# EAGLE board BEP33_rev1 (EAGLE 7.7.0), part 1 of 3
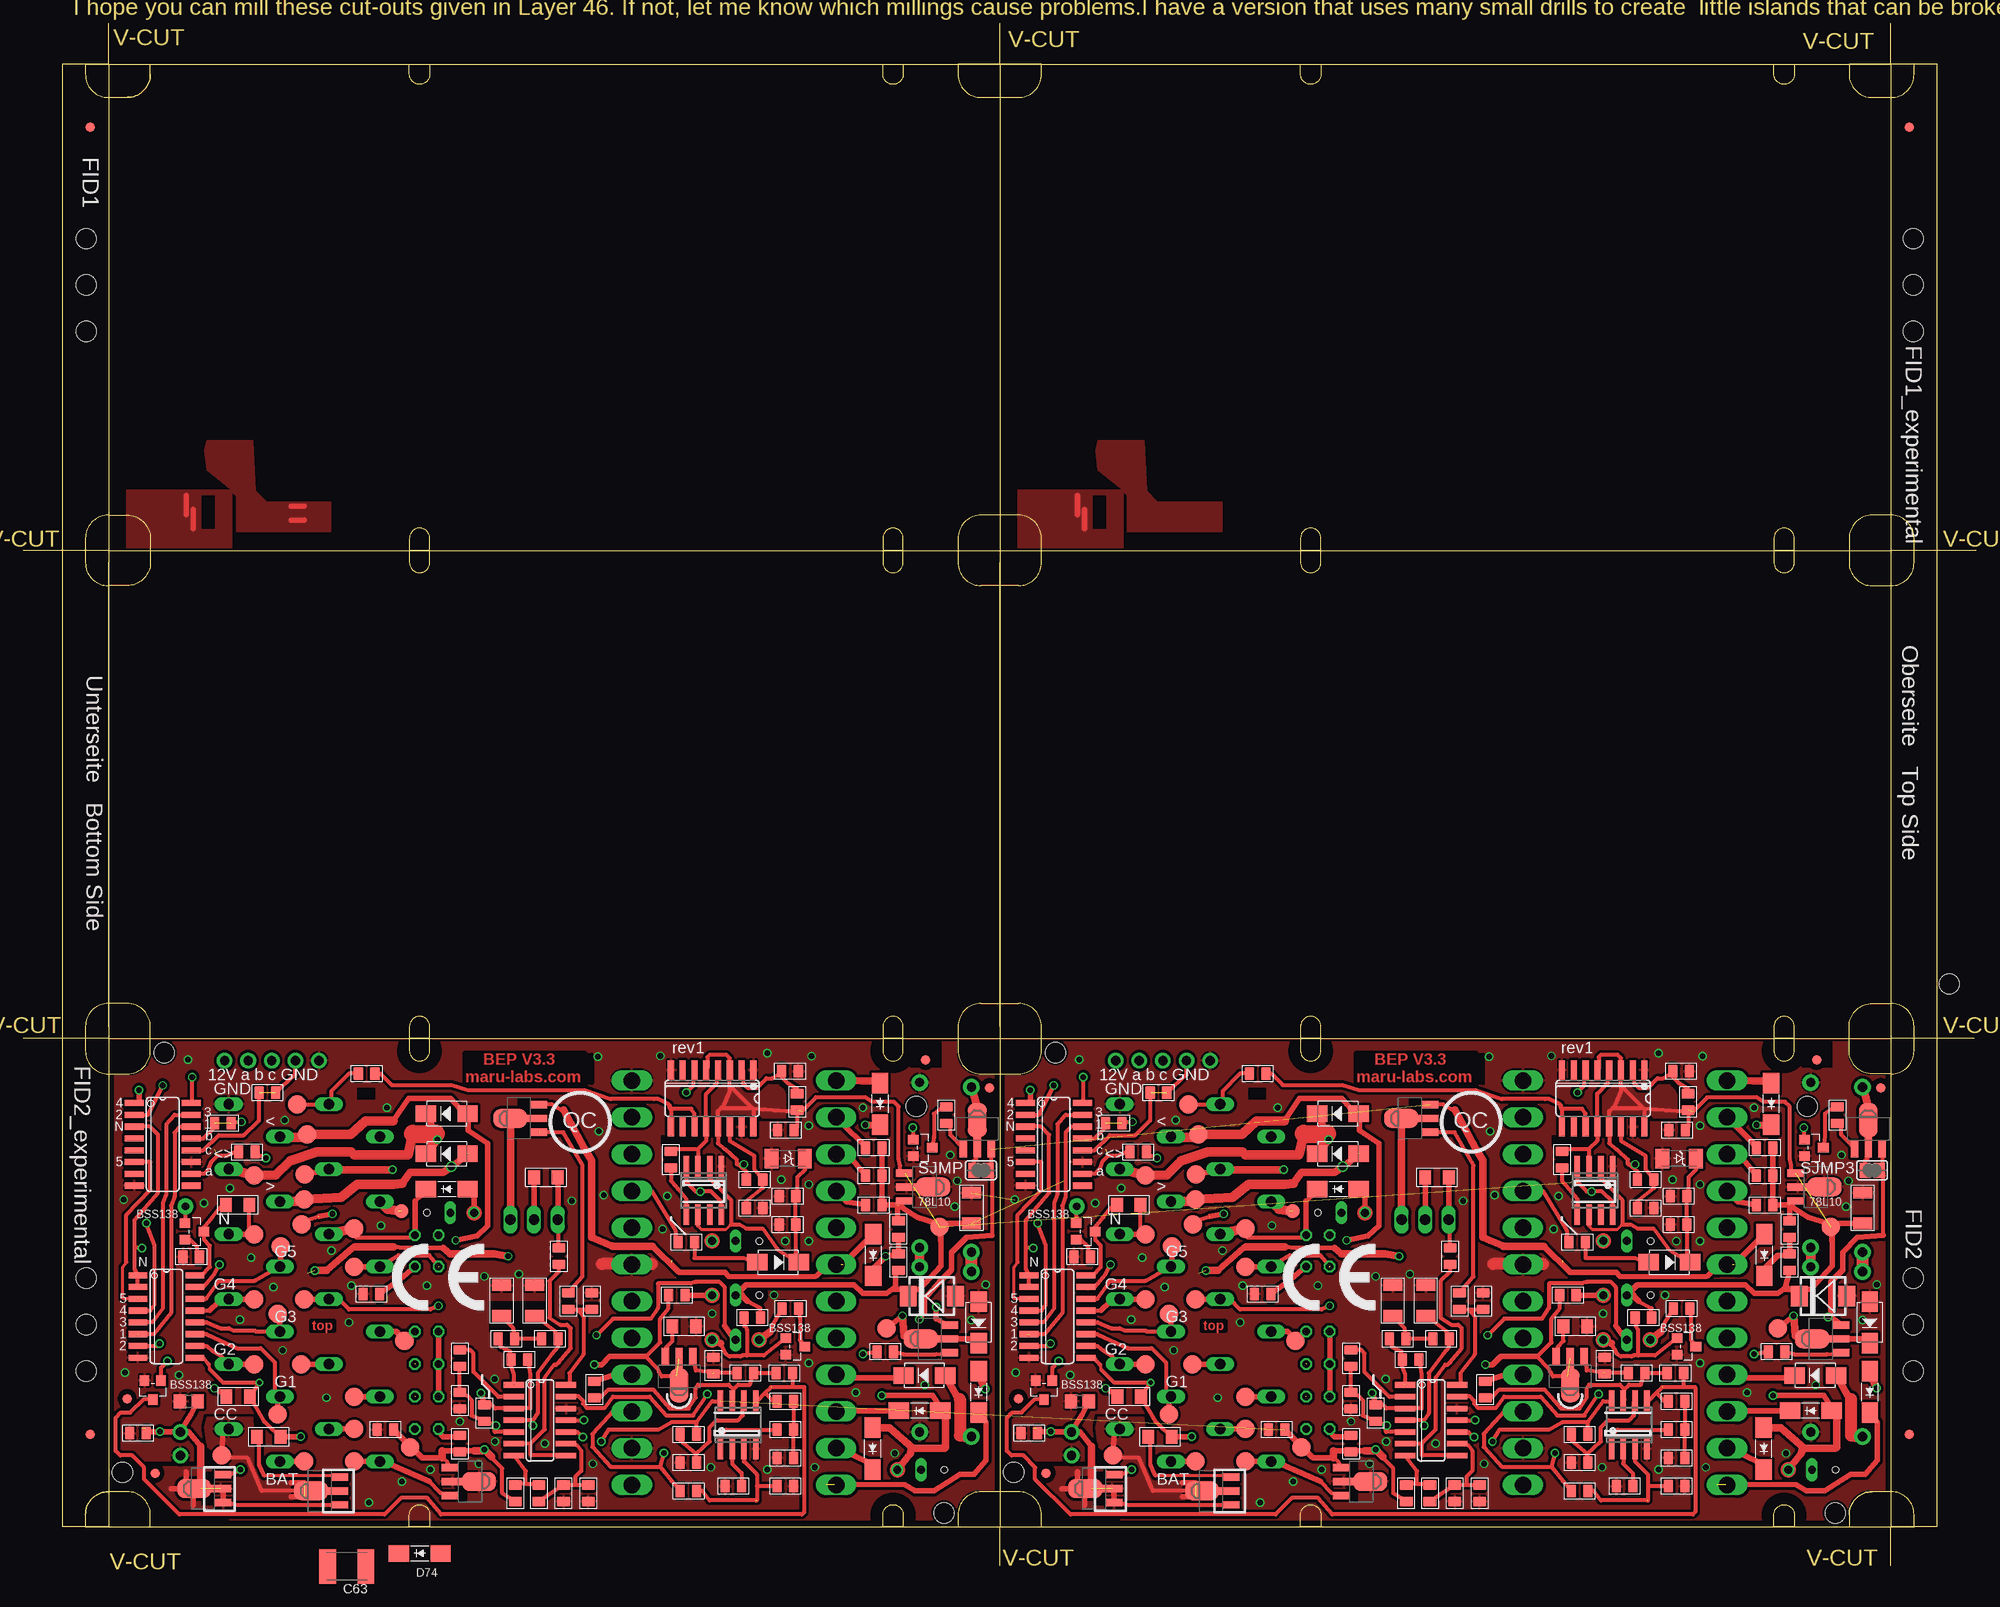
[diagram p5: board, top side]
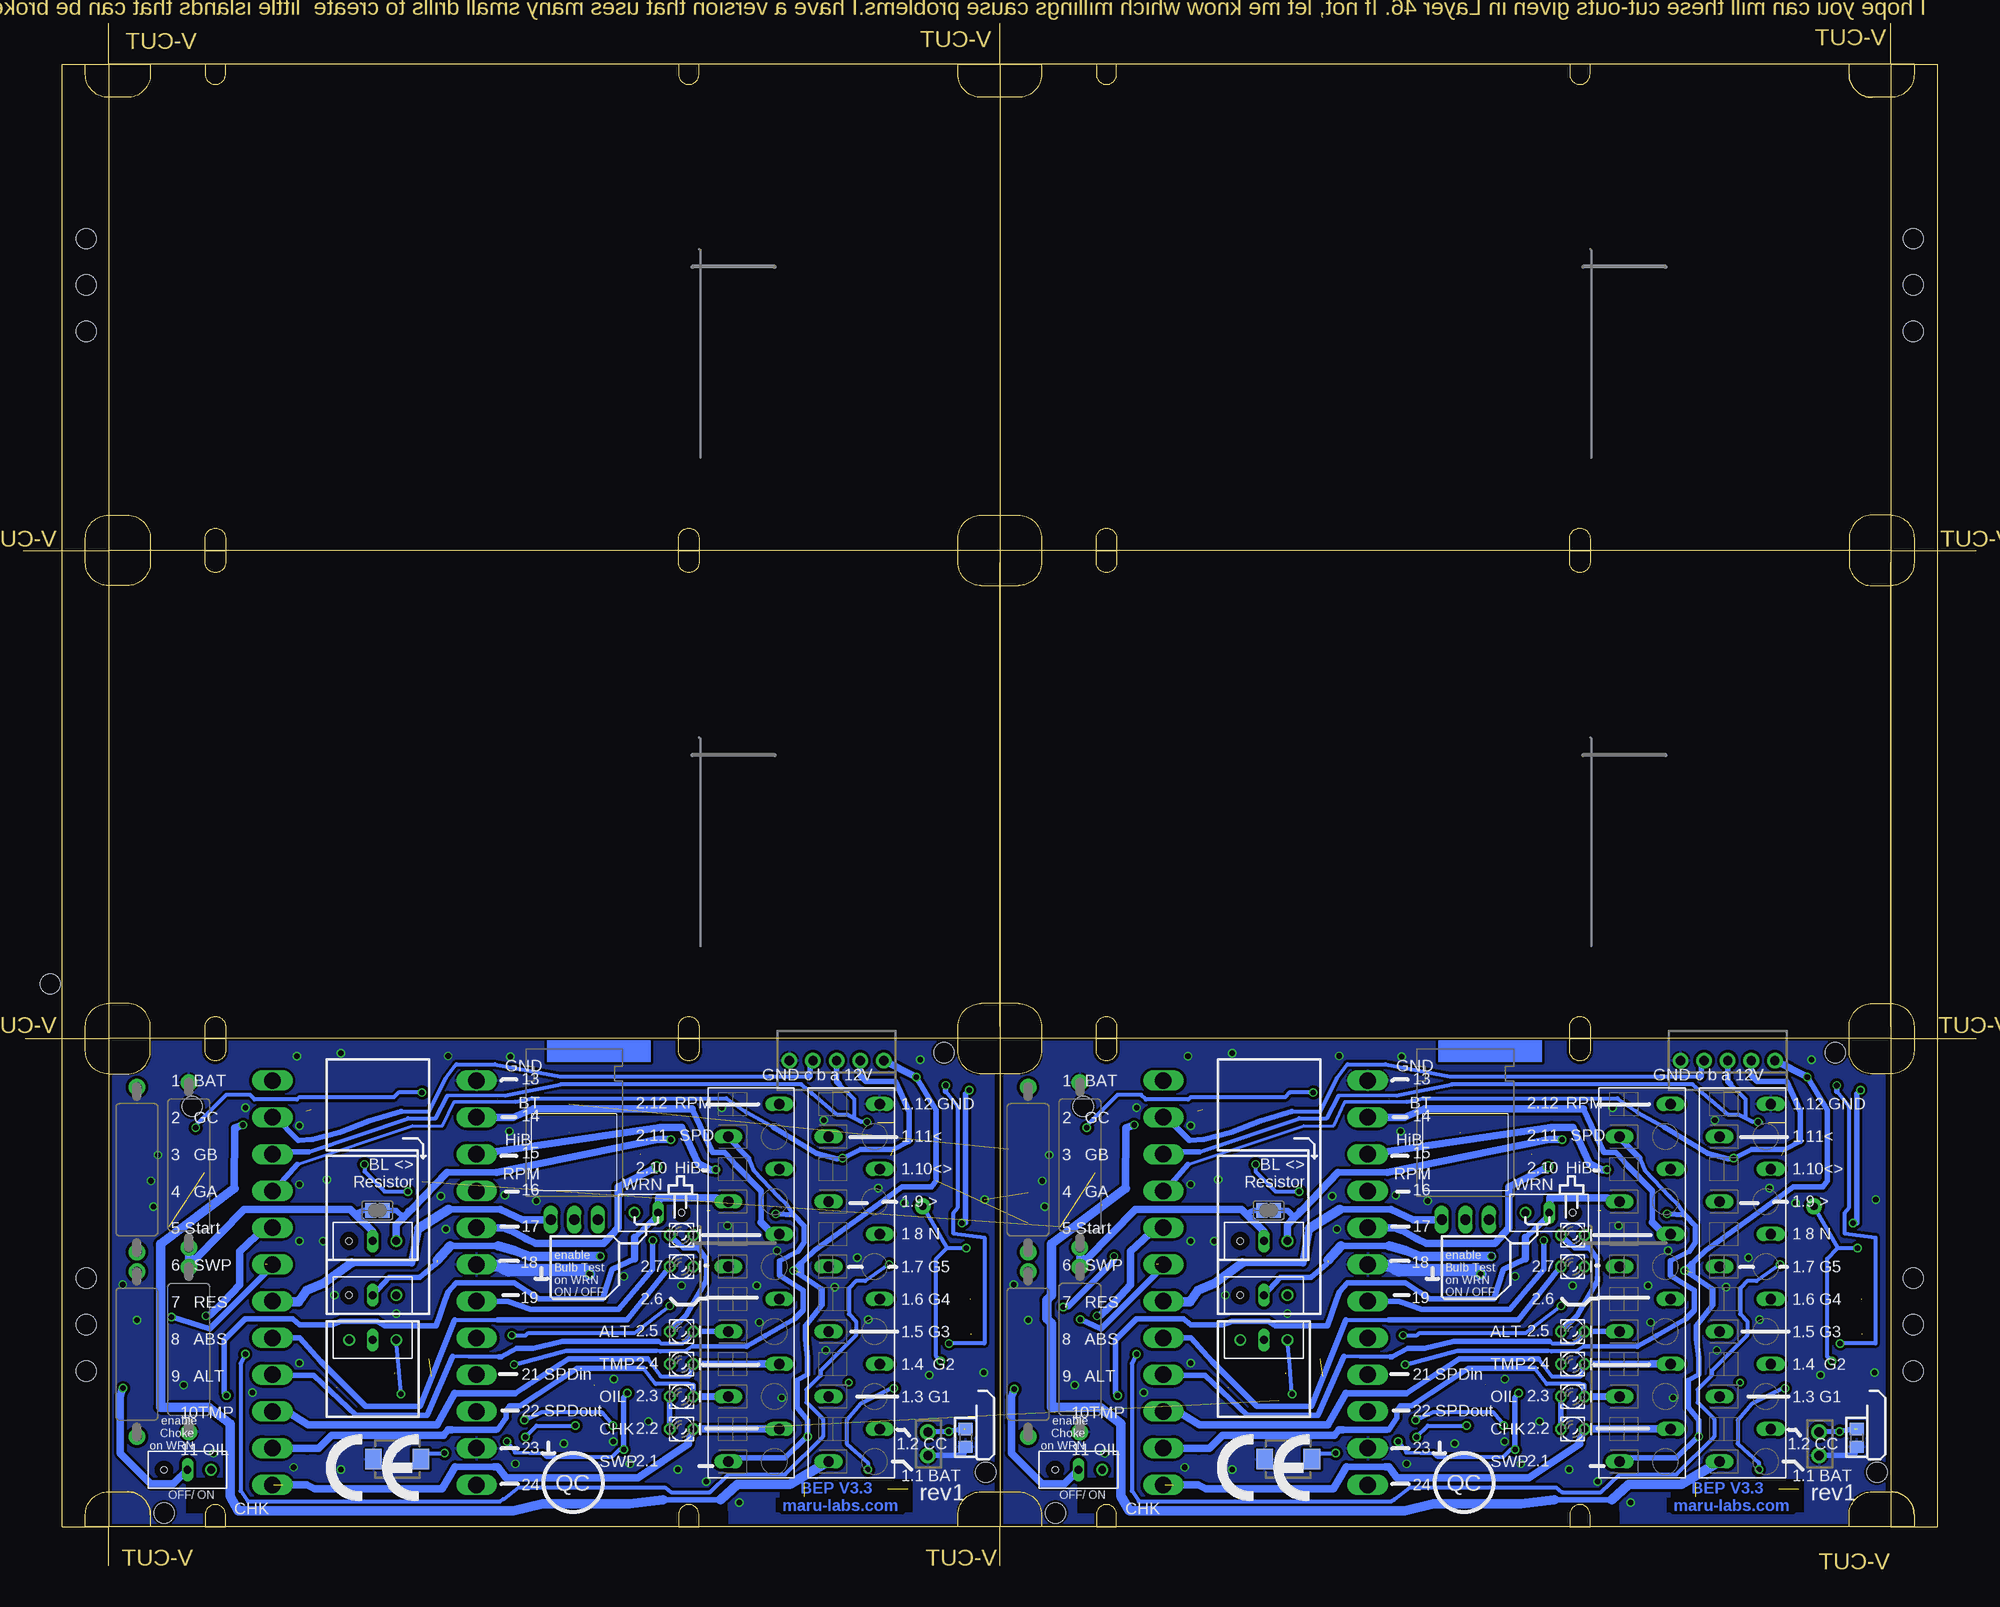
[diagram p6: board, bottom side, seen from below]

Size 210.4 x 166.2 mm. Coordinates in mm from the lower left corner, seen from the top.
Outline: 9.2,4.2 4.2,4.2 4.2,56.8
Outline: 9.2,56.8 4.2,56.8
Outline: 4.2,109.4 4.2,56.8
Outline: 9.2,161.8 9.2,109.4
Outline: 9.2,109.4 4.2,109.4
Outline: 4.2,109.4 4.2,161.8 9.2,161.8
Outline: 9.2,161.8 105.2,161.8
Outline: 201.2,4.2 206.2,4.2 206.2,56.8
Outline: 206.2,56.8 201.2,56.8
Outline: 206.2,56.8 206.2,109.4
Outline: 201.2,161.8 201.2,109.4
Outline: 105.2,161.8 105.2,109.4
Outline: 206.2,109.4 201.2,109.4
Outline: 206.2,109.4 206.2,161.8 201.2,161.8
Outline: 105.2,161.8 201.2,161.8
Outline: 105.2,161.8 105.2,166.2
Outline: 105.2,0 105.2,4.2
Outline: 201.2,0 201.2,4.2
Outline: 201.2,161.8 201.2,166.2
Outline: 9.2,161.8 9.2,166.2
Outline: 4.2,109.4 0,109.4
Outline: 4.2,56.8 0,56.8
Outline: 210.2,56.8 206.2,56.8
Outline: 210.4,109.4 206.2,109.4
Outline: 9.2,58.1 9.2,108.1
Outline: 105.2,58.1 105.2,108.1
Outline: 9.2,4.2 105.2,4.2
Outline: 9.2,56.8 9.2,4.2
Outline: 9.2,56.8 105.2,56.8
Outline: 9.2,109.4 9.2,56.8
Outline: 9.2,109.4 105.2,109.4
Outline: 105.2,4.2 201.2,4.2
Outline: 105.2,56.8 105.2,4.2
Outline: 201.2,56.8 201.2,4.2
Outline: 105.2,56.8 201.2,56.8
Outline: 105.2,109.4 105.2,56.8
Outline: 201.2,109.4 201.2,56.8
Outline: 105.2,109.4 201.2,109.4
Copper layers (1*16): Top 0.035mm / dielectric 1.5mm / Bottom 0.035mm
Design rules "Vorlage BEP3 und hoeher multi-cb_035um-cu": minimum track width 6mil, minimum drill 12mil, track to track 12mil, track to pad 12mil, pad to pad 6mil, via to via 6mil, smd to smd 6mil, copper to edge 10mil, drill to drill 8mil, minimum pad ring 8mil, minimum via ring 6mil, stop-mask expansion 3mil, vias tented up to drill 0mil, thermal gap 8mil
Holes 2.18 mm at 10.7,10.1 96.2,49.5 99.2,5.7 15.2,55.3 6.8,143 6.8,21 6.8,26 6.8,138 207.5,62.7 203.6,143 203.6,21 203.6,26 203.6,138 6.8,31 6.8,133 203.6,133 203.6,31 106.7,10.1 192.2,49.5 195.2,5.7 111.2,55.3
tRestrict: area 50.2,25.2 to 56.7,28.5; area 36,50.2 to 37.9,51.5; area 67.6,20.8 to 69.4,22.8; area 53.3,46.1 to 54.7,50.4; area 46.5,6.9 to 47.8,11.4; area 19.2,6.6 to 20.6,10.1; area 95.6,53.7 to 98.9,56.4; area 68.7,45.2 to 72.9,46.4; area 22.6,38.2 to 23.7,39.9; area 16.5,56.8 to 91.2,56.8; area 47.6,52 to 61.3,55.1; area 91.5,3.3 to 95.9,7.7; area 91.5,53.3 to 95.9,57.7; area 40.5,53.3 to 44.9,57.7; area 100.8,53.1 to 105,56.8; area 100.8,4.3 to 105.1,7.9; area 9.3,53.1 to 13.6,56.7; area 50.2,77.8 to 56.7,81.1; area 36,102.8 to 37.9,104.1; area 67.6,73.4 to 69.4,75.4; area 53.3,98.7 to 54.7,103; area 46.5,59.5 to 47.8,64; area 19.2,59.2 to 20.6,62.7; area 97.6,79.2 to 99.2,80.4; area 95.6,106.3 to 98.9,109; area 68.7,97.8 to 72.9,99; area 22.6,90.8 to 23.7,92.5; area 16.5,109.4 to 91.2,109.4; area 47.6,104.6 to 61.3,107.7; area 91.5,55.9 to 95.9,60.3; area 91.5,105.9 to 95.9,110.3; area 40.5,105.9 to 44.9,110.3; area 100.8,105.7 to 105,109.4; area 100.8,56.9 to 105.1,60.5; area 9.3,105.7 to 13.6,109.3; area 50.2,130.4 to 56.7,133.7; area 36,155.4 to 37.9,156.7; area 67.6,126 to 69.4,128; area 53.3,151.3 to 54.7,155.6; area 46.5,112.1 to 47.8,116.6; area 19.2,111.8 to 20.6,115.3; area 97.6,131.8 to 99.2,133; area 95.6,158.9 to 98.9,161.6; area 68.7,150.4 to 72.9,151.6; area 22.6,143.4 to 23.7,145.1; area 16.5,162 to 91.2,162; area 47.6,157.2 to 61.3,160.3; area 91.5,108.5 to 95.9,112.9; area 91.5,158.5 to 95.9,162.9; area 40.5,158.5 to 44.9,162.9; area 100.8,158.3 to 105,162; area 100.8,109.5 to 105.1,113.1; area 9.3,158.3 to 13.6,161.9; area 146.2,25.2 to 152.7,28.5; area 132,50.2 to 133.9,51.5; area 163.6,20.8 to 165.4,22.8; area 149.3,46.1 to 150.7,50.4; area 142.5,6.9 to 143.8,11.4; area 115.2,6.6 to 116.6,10.1; area 193.6,26.6 to 195.2,27.8; area 191.6,53.7 to 194.9,56.4; area 164.7,45.2 to 168.9,46.4; area 118.6,38.2 to 119.7,39.9; area 112.5,56.8 to 187.2,56.8; area 143.6,52 to 157.3,55.1; area 187.5,3.3 to 191.9,7.7; area 187.5,53.3 to 191.9,57.7; area 136.5,53.3 to 140.9,57.7; area 196.8,53.1 to 201,56.8; area 196.8,4.3 to 201.1,7.9; area 105.3,53.1 to 109.6,56.7; area 146.2,77.8 to 152.7,81.1; area 132,102.8 to 133.9,104.1; area 163.6,73.4 to 165.4,75.4; area 149.3,98.7 to 150.7,103; area 142.5,59.5 to 143.8,64; area 115.2,59.2 to 116.6,62.7; area 193.6,79.2 to 195.2,80.4; area 191.6,106.3 to 194.9,109; area 164.7,97.8 to 168.9,99; area 118.6,90.8 to 119.7,92.5; area 112.5,109.4 to 187.2,109.4; area 143.6,104.6 to 157.3,107.7; area 187.5,55.9 to 191.9,60.3; area 187.5,105.9 to 191.9,110.3; area 136.5,105.9 to 140.9,110.3; area 196.8,105.7 to 201,109.4; area 196.8,56.9 to 201.1,60.5; area 105.3,105.7 to 109.6,109.3; area 146.2,130.4 to 152.7,133.7; area 132,155.4 to 133.9,156.7; area 163.6,126 to 165.4,128; area 149.3,151.3 to 150.7,155.6; area 142.5,112.1 to 143.8,116.6; area 115.2,111.8 to 116.6,115.3; area 193.6,131.8 to 195.2,133; area 191.6,158.9 to 194.9,161.6; area 164.7,150.4 to 168.9,151.6; area 118.6,143.4 to 119.7,145.1; area 112.5,162 to 187.2,162; area 143.6,157.2 to 157.3,160.3; area 187.5,108.5 to 191.9,112.9; area 187.5,158.5 to 191.9,162.9; area 136.5,158.5 to 140.9,162.9; area 196.8,158.3 to 201,162; area 196.8,109.5 to 201.1,113.1; area 105.3,158.3 to 109.6,161.9
bRestrict: area 18.6,5.8 to 28.8,9.3; area 28.7,5.8 to 33.3,7.3; area 38.5,5.1 to 45,7.3; area 90.8,5.7 to 96.8,9.5; area 41.5,54.3 to 43.9,56.7; area 41.3,55.4 to 44.1,56.8; area 92.5,54.3 to 94.9,56.7; area 92.3,55.4 to 95.1,56.8; area 92.4,4.2 to 95,6.8; area 41.4,4.2 to 44,6.9; area 38.5,4.2 to 45.6,5.9; area 100.8,53.1 to 105,56.8; area 9.4,4.2 to 13.6,7.9; area 9.3,53.1 to 13.6,56.7; area 18.6,58.4 to 28.8,62; area 28.7,58.4 to 33.3,59.9; area 38.5,57.7 to 45,59.9; area 90.8,58.3 to 96.8,62.1; area 41.5,106.9 to 43.9,109.3; area 41.3,108 to 44.1,109.4; area 92.5,106.9 to 94.9,109.3; area 92.3,108 to 95.1,109.4; area 92.4,56.8 to 95,59.4; area 41.4,56.8 to 44,59.5; area 38.5,56.8 to 45.6,58.5; area 100.8,105.7 to 105,109.4; area 9.4,56.8 to 13.6,60.5; area 9.3,105.7 to 13.6,109.3; area 18.6,111 to 28.8,114.5; area 28.7,111 to 33.3,112.5; area 38.5,110.3 to 45,112.5; area 90.8,110.9 to 96.8,114.7; area 41.5,159.5 to 43.9,161.9; area 41.3,160.6 to 44.1,162; area 92.5,159.5 to 94.9,161.9; area 92.3,160.6 to 95.1,162; area 92.4,109.4 to 95,112; area 41.4,109.4 to 44,112.1; area 38.5,109.4 to 45.6,111.1; area 100.8,158.3 to 105,162; area 9.4,109.4 to 13.6,113.1; area 9.3,158.3 to 13.6,161.9; area 114.6,5.8 to 124.8,9.3; area 124.7,5.8 to 129.3,7.3; area 134.5,5.1 to 141,7.3; area 186.8,5.7 to 192.8,9.5; area 137.5,54.3 to 139.9,56.7; area 137.3,55.4 to 140.1,56.8; area 188.5,54.3 to 190.9,56.7; area 188.3,55.4 to 191.1,56.8; area 188.4,4.2 to 191,6.8; area 137.4,4.2 to 140,6.9; area 134.5,4.2 to 141.6,5.9; area 196.8,53.1 to 201,56.8; area 105.4,4.2 to 109.6,7.9; area 105.3,53.1 to 109.6,56.7; area 114.6,58.4 to 124.8,62; area 124.7,58.4 to 129.3,59.9; area 134.5,57.7 to 141,59.9; area 186.8,58.3 to 192.8,62.1; area 137.5,106.9 to 139.9,109.3; area 137.3,108 to 140.1,109.4; area 188.5,106.9 to 190.9,109.3; area 188.3,108 to 191.1,109.4; area 188.4,56.8 to 191,59.4; area 137.4,56.8 to 140,59.5; area 134.5,56.8 to 141.6,58.5; area 196.8,105.7 to 201,109.4; area 105.4,56.8 to 109.6,60.5; area 105.3,105.7 to 109.6,109.3; area 114.6,111 to 124.8,114.5; area 124.7,111 to 129.3,112.5; area 134.5,110.3 to 141,112.5; area 186.8,110.9 to 192.8,114.7; area 137.5,159.5 to 139.9,161.9; area 137.3,160.6 to 140.1,162; area 188.5,159.5 to 190.9,161.9; area 188.3,160.6 to 191.1,162; area 188.4,109.4 to 191,112; area 137.4,109.4 to 140,112.1; area 134.5,109.4 to 141.6,111.1; area 196.8,158.3 to 201,162; area 105.4,109.4 to 109.6,113.1; area 105.3,158.3 to 109.6,161.9
Milling: 188 lines

## Footprints (pad centres in the part's own frame; a part is rotated, then mirrored left to right if it is on the bottom)
12-PIN = drill 1.118 long: 1 19.25,-2.45; 2 15.75,3.05; 3 12.25,-2.45; 4 8.75,3.05; 5 5.25,-2.45; 6 1.75,3.05; 7 -1.75,-2.45; 8 -5.25,3.05; 9 -8.75,-2.45; 10 -12.25,3.05; 11 -15.75,-2.45; 12 -19.25,3.05
B2.0 = smd 2 x 2: TP 0,0
C1206 = smd 1.27 x 2.032: 1 -1.651,0; 2 1.651,0
C0805 = smd 1.397 x 1.016: 1 0,0.889; 2 0,-0.889
C1812K = smd 1.8 x 3.7: 1 -2.05,0; 2 2.05,0
DO-214AC_SLIM = smd 2.2 x 1.77: 1 -2.242,0; 2 2.242,0
SOD-123_MINI-SMA = smd 1.5 x 2.1: A 1.8,0; C -1.8,0
DO-214AC = smd 2.2 x 1.77: 1 -2.242,0; 2 2.242,0
DO214AA = smd 1.8 x 2.2: A 2.55,0; C -2.55,0
DO214AA_BI = smd 1.8 x 2.2: A 2.45,0; C -2.65,0
FIDUCIAL_1MM = smd 1 x 1: 1 0,0
FIDUCIAL_1MM_WITH_SOLDERMASK = smd 1 x 1: 1 0,0
SO16 = smd 0.66 x 2.032: 1 -4.445,-3.073; 2 -3.175,-3.073; 3 -1.905,-3.073; 4 -0.635,-3.073; 5 0.635,-3.073; 6 1.905,-3.073; 7 3.175,-3.073; 8 4.445,-3.073; 9 4.445,3.073; 10 3.175,3.073; 11 1.905,3.073; 12 0.635,3.073; 13 -0.635,3.073; 14 -1.905,3.073; 15 -3.175,3.073; 16 -4.445,3.073
TO220H_NOHOLE = drill 1.118 long: 1 -2.54,-10.16; 2 0,-10.16; 3 2.54,-10.16
SO14 = smd 0.6 x 2.2: 1 -3.81,-2.8; 2 -2.54,-2.8; 3 -1.27,-2.8; 4 0,-2.8; 5 1.27,-2.8; 6 2.54,-2.8; 7 3.81,-2.8; 8 3.81,2.8; 9 2.54,2.8; 10 1.27,2.8; 11 0,2.8; 12 -1.27,2.8; 13 -2.54,2.8; 14 -3.81,2.8
SOT89_ROUND = smd 0.8 x 1.8: 1 -1.499,-2.181; 3 1.499,-2.181 | smd 0.8 x 2.3: 2 0,-1.927 | smd 2.032 x 3.65: 2@1 0,0.94
SO08 = smd 0.6 x 2.2: 1 -1.905,-2.6; 2 -0.635,-2.6; 3 0.635,-2.6; 4 1.905,-2.6; 5 1.905,2.6; 6 0.635,2.6; 7 -0.635,2.6; 8 -1.905,2.6
JP2_SMALLPADS = drill 0.85: 1 -2.54,0 | drill 0.85 long: 2 0,0 | hole 0.7: 2.54,0
JP2_ORIG_SMALLPADS = drill 0.85: 1 -2.54,0; 3 2.54,0 | drill 0.85 long: 2 0,0
LD260 = drill 0.813 octagon: A -1.27,0; K 1.27,0
SOT-23 = smd 1.016 x 1.143: 1 -0.889,-1.016; 2 0.889,-1.016; 3 0,1.016
SOT89 = smd 0.8 x 1.8: 1 -1.499,-2.181; 3 1.499,-2.181 | smd 0.8 x 2.3: 2 0,-1.927 | smd 2.032 x 3.65: 2@1 0,0.94
R0805 = smd 1.397 x 1.016: 1 0,0.889; 2 0,-0.889
R1206 = smd 1.27 x 1.524: 1 -1.27,0; 2 1.27,0
R0805' = smd 1.3 x 1.5: 1 -0.95,0; 2 0.95,0
V235/17_1MM = drill 1 pad 1.778: 1 -8.89,0; 2 8.89,0
SJ = smd 1.2 x 1.6: 1 -0.725,0; 2 0.725,0
SJ' = smd 1.168 x 1.6: 1 -0.762,0; 2 0.762,0
B1,27 = smd 1.5 x 1.5: TP 0,0
24-PIN_V2 = drill 1.778 long: 1 -21.78,-11; 2 -17.82,-11; 3 -13.86,-11; 4 -9.9,-11; 5 -5.94,-11; 6 -1.98,-11; 7 1.98,-11; 8 5.94,-11; 9 9.9,-11; 10 13.86,-11; 11 17.82,-11; 12 21.78,-11; 13 -21.78,11; 14 -17.82,11; 15 -13.86,11; 16 -9.9,11; 17 -5.94,11; 18 -1.98,11; 19 1.98,11; 20 5.94,11; 21 9.9,11; 22 13.86,11; 23 17.82,11; 24 21.78,11
22-23-2051 = drill 1 pad 1.676: 1 -5.08,0; 2 -2.54,0; 3 0,0; 4 2.54,0; 5 5.08,0
22-23-2021 = drill 1 pad 1.676: 1 -1.27,0; 2 1.27,0

## Placement (x,y rotation side)
1  [12-PIN]  25.19,30.5 270 bottom
2  [12-PIN]  35.98,30.5 270 bottom
6V  TPSB2.0  [B2.0]  41.7,12.78 0 top
6V3  TPSB2.0  [B2.0]  137.7,12.78 0 top
7  [12-PIN]  121.19,30.5 270 bottom
8  [12-PIN]  131.98,30.5 270 bottom
10V  TPSB2.0  [B2.0]  98.7,36.5 0 top
10V3  TPSB2.0  [B2.0]  194.7,36.5 0 top
C2  10u  [C1206]  102.16,38.56 90 top
C15  4.7u  [C0805]  82.61,53.29 270 top
C27  100u  [C1206]  147.54,28.59 90 top
C28  100u  [C1206]  151.1,28.59 90 top
C29  100nF,  [C0805]  135.03,14.68 270 top
C30  4.7u  [C0805]  178.1,8.59 90 top
C31  100nF.  [C0805]  154.21,7.83 0 top
C32  100nF.  [C0805]  157.26,28.53 0 top
C33  2.2nF  [C0805]  178.34,36.78 90 top
C34  100nF  [C0805]  178.16,46.95 270 top
C35  100nF  [C0805]  174.78,38.56 90 top
C36  100nF,  [C0805]  178.1,11.64 270 top
C37  4.7u  [C0805]  178.61,53.29 270 top
C38  10u  [C1206]  198.16,38.56 90 top
C63  [C1812K]  34.85,-0.05 180 top
C101  4.7u  [C0805]  82.1,8.59 90 top
C102  100nF  [C0805]  82.16,46.95 270 top
C103  100nF,  [C0805]  82.1,11.64 270 top
C104  100nF,  [C0805]  39.03,14.68 270 top
C105  100nF.  [C0805]  58.21,7.83 0 top
C106  100nF.  [C0805]  61.26,28.53 0 top
C107  100u  [C1206]  51.54,28.59 90 top
C108  100u  [C1206]  55.1,28.59 90 top
C109  2.2nF  [C0805]  82.34,36.78 90 top
C110  100nF  [C0805]  78.78,38.56 90 top
D1  SS12  [DO-214AC_SLIM]  91.56,33.49 270 top
D2  SS12  [DO-214AC_SLIM]  92.3,49.78 270 top
D4  Zen11  [SOD-123_MINI-SMA]  82.4,43.88 180 top
D32  1N4007,  [DO-214AC]  141.64,44.4 180 top
D33  1N4007,  [DO-214AC]  141.64,48.72 180 top
D34  1N4007.  [DO-214AC]  193.07,20.53 180 top
D35  1N5817  [DO-214AC_SLIM]  192.56,16.72 180 top
D36  1N5817.  [DO-214AC_SLIM]  187.5,12.64 270 top
D37  1N5817.  [DO-214AC_SLIM]  198.93,18.75 270 top
D38  1N5817  [DO-214AC_SLIM]  141.64,40.59 180 top
D39  1N4007.  [DO-214AC]  198.93,26.24 270 top
D40  1N4007  [DO-214AC]  177.32,32.72 0 top
D41  Zen15  [DO214AA]  193.89,29.07 0 top
D42  SM6TDO214AA_BI  [DO214AA_BI]  170.21,11.51 180 bottom
D43  SS12  [DO-214AC_SLIM]  187.56,33.49 270 top
D44  SS12  [DO-214AC_SLIM]  188.3,49.78 270 top
D45  Zen11  [SOD-123_MINI-SMA]  178.4,43.88 180 top
D74  SS12  [DO-214AC_SLIM]  42.73,1.35 180 top
D101  Zen15  [DO214AA]  97.89,29.07 0 top
D102  1N4007,  [DO-214AC]  45.64,44.4 180 top
D103  1N4007,  [DO-214AC]  45.64,48.72 180 top
D104  SM6TDO214AA_BI  [DO214AA_BI]  74.21,11.51 180 bottom
D105  1N4007.  [DO-214AC]  102.93,26.24 270 top
D106  1N4007.  [DO-214AC]  97.07,20.53 180 top
D107  1N5817  [DO-214AC_SLIM]  96.56,16.72 180 top
D108  1N5817.  [DO-214AC_SLIM]  91.5,12.64 270 top
D109  1N5817.  [DO-214AC_SLIM]  102.93,18.75 270 top
D110  1N5817  [DO-214AC_SLIM]  45.64,40.59 180 top
D112  1N4007  [DO-214AC]  81.32,32.72 0 top
FID1  FIDUCIAL  [FIDUCIAL_1MM]  7.2,155 0 top
FID1B  FIDUCIALFIDUCIAL_1MM_WITH_SOLDERMASK  [FIDUCIAL_1MM_WITH_SOLDERMASK]  203.2,155 0 top
FID2  FIDUCIAL  [FIDUCIAL_1MM]  203.2,14.2 0 top
FID2B  FIDUCIALFIDUCIAL_1MM_WITH_SOLDERMASK  [FIDUCIAL_1MM_WITH_SOLDERMASK]  7.2,14.2 0 top
FID11  FIDUCIAL  [FIDUCIAL_1MM]  193.2,54.5 0 top
FID12  FIDUCIAL  [FIDUCIAL_1MM]  107.2,18 0 top
FID13  FIDUCIAL  [FIDUCIAL_1MM]  110.2,10 0 top
FID14  FIDUCIAL  [FIDUCIAL_1MM]  200.1,51.5 0 top
FID101  FIDUCIAL  [FIDUCIAL_1MM]  97.2,54.5 0 top
FID102  FIDUCIAL  [FIDUCIAL_1MM]  11.2,18 0 top
FID103  FIDUCIAL  [FIDUCIAL_1MM]  14.2,10 0 top
FID104  FIDUCIAL  [FIDUCIAL_1MM]  104.1,51.5 0 top
IC19  4028  [SO16]  111.03,45.42 270 top
IC20  317TO202H_NOHOLE  [TO220H_NOHOLE]  151.03,47.45 0 bottom
IC21  ULN2004  [SO16]  111.43,26.88 270 top
IC22  LM339  [SO14]  151.67,15.7 270 top
IC23  78L06  [SOT89_ROUND]  144.18,9.1 270 top
IC24  555  [SO08]  169.32,40.47 180 top
IC25  4538  [SO16]  170.21,50.37 180 top
IC26  78L10  [SOT89_ROUND]  193.11,40.82 270 top
IC27  LM2904  [SO08]  173.01,15.19 0 top
IC101  LM2904  [SO08]  77.01,15.19 0 top
IC102  78L06  [SOT89_ROUND]  48.18,9.1 270 top
IC104  78L10  [SOT89_ROUND]  97.11,40.82 270 top
IC105  4028  [SO16]  15.03,45.42 270 top
IC107  ULN2004  [SO16]  15.43,26.88 270 top
IC108  LM339  [SO14]  55.67,15.7 270 top
IC109  317TO202H_NOHOLE  [TO220H_NOHOLE]  55.03,47.45 0 bottom
IC110  555  [SO08]  73.32,40.47 180 top
IC111  4538  [SO16]  74.21,50.37 180 top
JP11  [JP2_SMALLPADS]  172.75,29.16 180 bottom
JP12  JP2E_ORIG  [JP2_ORIG_SMALLPADS]  172.75,24.34 180 bottom
JP13  [JP2_SMALLPADS]  192.7,10.35 180 bottom
JP14  [JP2_SMALLPADS]  142.02,38.05 0 bottom
JP15  [JP2_SMALLPADS]  172.75,35 180 bottom
JP101  [JP2_SMALLPADS]  76.75,29.16 180 bottom
JP102  [JP2_SMALLPADS]  96.7,10.35 180 bottom
JP103  [JP2_SMALLPADS]  46.02,38.05 0 bottom
JP104  [JP2_SMALLPADS]  76.75,35 180 bottom
JP105  JP2E_ORIG  [JP2_ORIG_SMALLPADS]  76.75,24.34 180 bottom
LED13  [LD260]  139.48,14.75 0 bottom
LED14  [LD260]  139.48,18.25 0 bottom
LED15  [LD260]  139.48,21.75 0 bottom
LED16  [LD260]  139.48,25.25 0 bottom
LED17  [LD260]  139.48,32.25 0 bottom
LED18  [LD260]  139.48,35.62 0 bottom
LED101  [LD260]  43.48,32.25 0 bottom
LED102  [LD260]  43.48,14.75 0 bottom
LED103  [LD260]  43.48,18.25 0 bottom
LED104  [LD260]  43.48,21.75 0 bottom
LED105  [LD260]  43.48,25.25 0 bottom
LED106  [LD260]  43.48,35.62 0 bottom
Q1  J1  [SOT-23]  13.97,18.96 180 top
Q2  BA  [SOT89]  102.77,47.08 0 top
Q3  J1  [SOT-23]  96.9,45.05 270 top
Q24  BA  [SOT89]  193.64,24.46 90 top
Q25  BA.  [SOT89]  115.35,8.33 90 top
Q26  BA.  [SOT89]  127.93,8.08 90 top
Q27  BA  [SOT89]  149.38,48.21 90 top
Q28  MY  [SOT89]  166.66,20.4 180 top
Q29  J1  [SOT-23]  179.17,23.64 270 top
Q30  J1  [SOT-23]  114.46,36.02 270 top
Q31  J1  [SOT-23]  109.97,18.96 180 top
Q32  BA  [SOT89]  198.77,47.08 0 top
Q33  J1  [SOT-23]  192.9,45.05 270 top
Q101  BA.  [SOT89]  31.93,8.08 90 top
Q102  BA.  [SOT89]  19.35,8.33 90 top
Q103  MY  [SOT89]  70.66,20.4 180 top
Q104  BA  [SOT89]  97.64,24.46 90 top
Q105  BA  [SOT89]  53.38,48.21 90 top
Q106  J1  [SOT-23]  18.46,36.02 270 top
Q107  J1  [SOT-23]  83.17,23.64 270 top
R1  104  [R0805]  26.3,51 90 top
R2  104  [R0805]  21.5,47.7 90 top
R3  104  [R0805]  24.1,44.6 90 top
R4  100  [R0805]  18.1,33.3 90 top
R5  13  [R1206]  71.2,25.8 0 top
R6  2201  [R0805]  74.36,21.6 180 top
R8  4701  [R0805]  99.43,48.58 180 top
R9  13  [R1206]  23.1,38.9 0 top
R10  104  [R0805]  83.37,49.99 0 top
R12  100  [R0805]  94.29,32.72 0 top
R13  100  [R0805]  94.29,36.27 180 top
R101  102  [R0805]  12.36,14.3 270 top
R102  13  [R1206]  26.46,13.92 180 top
R103  R_user  [R0805']  17.84,17.73 180 top
R104  R_user  [R0805']  12.87,13.79 270 bottom
R105  4701  [R0805]  71.67,8.08 270 top
R106  13  [R1206]  23.16,18.24 180 top
R107  1002  [R0805]  76.5,8.59 90 top
R108  1002  [R0805]  82.1,14.68 270 top
R109  104  [R0805]  91.61,45.04 90 top
R110  104  [R0805]  91.61,42.05 90 top
R111  104  [R0805]  91.61,38.88 90 top
R112  102  [R0805]  82.1,17.73 270 top
R113  1002  [R0805]  71.67,14.18 90 top
R114  1002  [R0805]  71.67,11.13 90 top
R115  102  [R0805]  61.51,19 0 top
R116  4701  [R0805]  77.81,20.78 270 top
R117  2702  [R0805]  81.98,20.78 90 top
R119  2201  [R0805]  70.4,29.16 90 top
R120  1002  [R0805]  57.7,33.35 180 top
R121  1502  [R0805]  53,7.83 0 top
R122  2702  [R0805]  55.54,7.83 0 top
R123  2702  [R0805]  60.88,7.83 180 top
R124  1002  [R0805]  53.45,22.24 270 top
R125  104  [R0805]  52.05,24.46 270 top
R126  4701  [R0805]  58.72,28.53 0 top
R127  47  [V235/17_1MM]  102.15,22.81 90 bottom
R128  102  [R0805]  92.88,23.07 90 top
R129  47  [V235/17_1MM]  102.15,42.69 90 bottom
R130  104  [R0805]  56.75,24.46 270 top
R131  1502  [R0805]  49.7,16.46 180 top
R132  1002  [R0805]  47.03,17.8 180 top
R133  2201  [R0805]  47.03,22.37 0 top
R134  13  [R1206]  56.3,41.86 180 top
R135  104  [R0805]  78.53,26.75 270 top
R136  47  [V235/17_1MM]  96.56,23.32 90 bottom
R137  47  [V235/17_1MM]  96.56,43.2 270 bottom
R138  100  [R0805]  82.66,27.7 90 top
R140  2702  [R0805]  71.42,34.88 270 top
R141  104  [R0805]  82.34,39.83 270 top
R142  (1000)  [R0805]  47.03,13.16 0 top
R143  (101)  [R0805]  37.51,29.29 270 top
R144  (1002)  [R0805]  69.77,43.77 0 top
R145  2702  [R0805]  78.78,41.61 270 top
R146  1002  [R0805]  37,53.04 90 top
R166  47  [V235/17_1MM]  198.15,22.81 90 bottom
R167  13  [R1206]  152.3,41.86 180 top
R168  47  [V235/17_1MM]  198.15,42.69 90 bottom
R169  104  [R0805]  187.61,45.04 90 top
R170  104  [R0805]  187.61,42.05 90 top
R171  104  [R0805]  187.61,38.88 90 top
R172  4701  [R0805]  167.67,8.08 270 top
R173  1002  [R0805]  172.5,8.59 90 top
R174  1002  [R0805]  153.7,33.35 180 top
R175  1502  [R0805]  149,7.83 0 top
R176  104  [R0805]  148.05,24.46 270 top
R177  104  [R0805]  152.75,24.46 270 top
R178  1502  [R0805]  145.7,16.46 180 top
R179  1002  [R0805]  143.03,17.8 180 top
R180  2201  [R0805]  143.03,22.37 0 top
R181  1002  [R0805]  149.45,22.24 270 top
R182  4701  [R0805]  154.72,28.53 0 top
R183  2702  [R0805]  156.88,7.83 180 top
R184  102  [R0805]  108.36,14.3 270 top
R185  R_user  [R0805']  108.87,13.79 270 bottom
R186  102  [R0805]  157.51,19 0 top
R187  (101)  [R0805]  133.51,29.29 270 top
R188  (1000)  [R0805]  143.03,13.16 0 top
R189  102  [R0805]  188.88,23.07 90 top
R190  13  [R1206]  119.16,18.24 180 top
R191  13  [R1206]  122.46,13.92 180 top
R192  2702  [R0805]  151.54,7.83 0 top
R193  4701  [R0805]  173.81,20.78 270 top
R194  100  [R0805]  178.66,27.7 90 top
R195  104  [R0805]  174.53,26.75 270 top
R196  104  [R0805]  178.34,39.83 270 top
R197  (1002)  [R0805]  165.77,43.77 0 top
R198  2702  [R0805]  167.42,34.88 270 top
R199  47  [V235/17_1MM]  192.56,23.32 90 bottom
R200  47  [V235/17_1MM]  192.56,43.2 270 bottom
R201  2702  [R0805]  174.78,41.61 270 top
R202  2201  [R0805]  166.4,29.16 90 top
R203  1002  [R0805]  133,53.04 90 top
R204  1002  [R0805]  178.1,14.68 270 top
R205  102  [R0805]  178.1,17.73 270 top
R206  2702  [R0805]  177.98,20.78 90 top
R207  1002  [R0805]  167.67,14.18 90 top
R208  1002  [R0805]  167.67,11.13 90 top
R209  R_user  [R0805']  113.84,17.73 180 top
R210  104  [R0805]  122.3,51 90 top
R211  104  [R0805]  117.5,47.7 90 top
R212  104  [R0805]  120.1,44.6 90 top
R213  13  [R1206]  167.2,25.8 0 top
R214  2201  [R0805]  170.36,21.6 180 top
R215  100  [R0805]  114.1,33.3 90 top
R216  13  [R1206]  119.1,38.9 0 top
R217  4701  [R0805]  195.43,48.58 180 top
R218  104  [R0805]  179.37,49.99 0 top
R219  100  [R0805]  190.29,32.72 0 top
R220  100  [R0805]  190.29,36.27 180 top
SJ3  [SJ]  172.24,38.31 180 bottom
SJ101  [SJ]  76.24,38.31 180 bottom
SJMP  [SJ']  103.18,42.62 180 top
SJMP3  [SJ']  199.18,42.62 180 top
START  TPSB2.0  [B2.0]  93.01,25.61 0 top
START3  TPSB2.0  [B2.0]  189.01,25.61 0 top
TP1  TPSB2.0  [B2.0]  30.27,11.26 0 top
TP2  TPSB2.0  [B2.0]  21.38,11.89 0 top
TP3  TPSB2.0  [B2.0]  27.41,16.34 0 top
TP4  TPSB2.0  [B2.0]  24.87,21.73 0 top
TP5  TPSB2.0  [B2.0]  27.41,27.13 0 top
TP6  TPSB2.0  [B2.0]  24.87,28.72 0 top
TP7  TPSB2.0  [B2.0]  27.73,34.43 0 top
TP8  TPSB2.0  [B2.0]  24.87,35.7 0 top
TP9  TPSB2.0  [B2.0]  30.27,39.51 0 top
TP10  TPSB2.0  [B2.0]  24.87,42.05 0 top
TP11  TPSB2.0  [B2.0]  30.59,46.5 0 top
TP12  TPSB2.0  [B2.0]  35.67,11.26 0 top
TP13  TPSB2.0  [B2.0]  29.51,49.74 0 top
TP16  TPSB2.0  [B2.0]  35.67,14.75 0 top
TP17  TPSB2.0  [B2.0]  35.67,18.24 0 top
TP18  TPSB2.0  [B2.0]  29.95,21.73 0 top
TP19  TPSB2.0  [B2.0]  41.06,24.27 0 top
TP21  TPSB2.0  [B2.0]  30.27,28.72 0 top
TP22  TPSB2.0  [B2.0]  35.67,32.21 0 top
TP23  TPSB2.0  [B2.0]  35.67,36.34 0 top
TP24  TPSB1,27  [B1,27]  40.75,38.24 0 top
TP25  TPSB2.0  [B2.0]  30.33,42.18 0 top
TP26  TPSB2.0  [B2.0]  30.02,36.78 0 top
TP70  TPSB2.0  [B2.0]  126.27,11.26 0 top
TP71  TPSB2.0  [B2.0]  117.38,11.89 0 top
TP72  TPSB2.0  [B2.0]  123.41,16.34 0 top
TP73  TPSB2.0  [B2.0]  120.87,21.73 0 top
TP74  TPSB2.0  [B2.0]  123.41,27.13 0 top
TP75  TPSB2.0  [B2.0]  120.87,28.72 0 top
TP76  TPSB2.0  [B2.0]  123.73,34.43 0 top
TP77  TPSB2.0  [B2.0]  120.87,35.7 0 top
TP78  TPSB2.0  [B2.0]  126.27,39.51 0 top
TP79  TPSB2.0  [B2.0]  120.87,42.05 0 top
TP80  TPSB2.0  [B2.0]  126.59,46.5 0 top
TP81  TPSB2.0  [B2.0]  131.67,14.75 0 top
TP82  TPSB2.0  [B2.0]  131.67,18.24 0 top
TP83  TPSB2.0  [B2.0]  125.95,21.73 0 top
TP84  TPSB2.0  [B2.0]  137.06,24.27 0 top
TP85  TPSB2.0  [B2.0]  126.27,28.72 0 top
TP86  TPSB2.0  [B2.0]  131.67,32.21 0 top
TP87  TPSB2.0  [B2.0]  131.67,36.34 0 top
TP88  TPSB1,27  [B1,27]  136.75,38.24 0 top
TP89  TPSB2.0  [B2.0]  126.33,42.18 0 top
TP90  TPSB2.0  [B2.0]  126.02,36.78 0 top
TP91  TPSB2.0  [B2.0]  131.67,11.26 0 top
TP92  TPSB2.0  [B2.0]  125.51,49.74 0 top
U$1  [CE_10.00]  81.83,6.94 0 bottom
U$2  [CE_10.00]  39.67,27.47 0 top
U$7  [CE_10.00]  177.83,6.94 0 bottom
U$8  [CE_10.00]  135.67,27.47 0 top
X7  [24-PIN_V2]  172.56,30.5 270 bottom
X8  22-23-2051  [22-23-2051]  122.78,54.44 180 bottom
X9  22-23-2021  [22-23-2021]  112.94,13.16 90 bottom
X101  [24-PIN_V2]  76.56,30.5 270 bottom
X102  22-23-2021  [22-23-2021]  16.93,13.16 90 bottom
X103  22-23-2051  [22-23-2051]  26.78,54.44 180 bottom